# EAGLE design TRF_PCB_021726 (EAGLE 9.6.2)
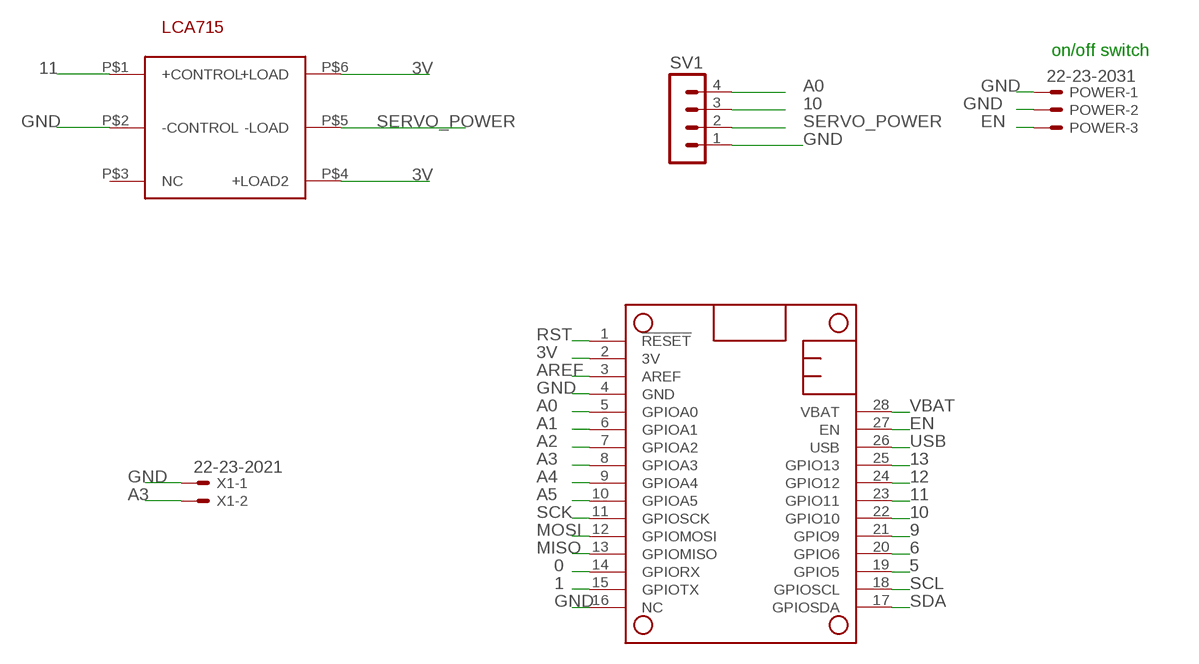
[diagram p0: schematic, sheet 1]

## Parts
MS2  MICROSHIELD_NODIM  [MICROSHIELD_DIM]
POWER  22-23-2031  [22-23-2031]
SSR3  LCA715S  [LCA7XX]
SV1  MA04-1  [MA04-1]
X1  22-23-2021  [22-23-2021]

## Nets
0: MS2.14(GPIORX)
1: MS2.15(GPIOTX)
3V: MS2.2(3V) SSR3.P$4(+LOAD2) SSR3.P$6(+LOAD)
5: MS2.19(GPIO5)
6: MS2.20(GPIO6)
9: MS2.21(GPIO9)
10: MS2.22(GPIO10) SV1.3
11: MS2.23(GPIO11) SSR3.P$1(+CONTROL)
12: MS2.24(GPIO12)
13: MS2.25(GPIO13)
A0: MS2.5(GPIOA0) SV1.4
A1: MS2.6(GPIOA1)
A2: MS2.7(GPIOA2)
A3: MS2.8(GPIOA3) X1.2
A4: MS2.9(GPIOA4)
A5: MS2.10(GPIOA5)
AREF: MS2.3(AREF)
EN: MS2.27(EN) POWER.3
GND: MS2.4(GND) MS2.16(NC) POWER.1 POWER.2 SSR3.P$2(-CONTROL) SV1.1 X1.1
MISO: MS2.13(GPIOMISO)
MOSI: MS2.12(GPIOMOSI)
RST: MS2.1(!RESET)
SCK: MS2.11(GPIOSCK)
SCL: MS2.18(GPIOSCL)
SDA: MS2.17(GPIOSDA)
SERVO_POWER: SSR3.P$5(-LOAD) SV1.2
USB: MS2.26(USB)
VBAT: MS2.28(VBAT)
Unconnected: SSR3.P$3(NC)

## Notes on the sheet
- on/off switch

## Library data of the parts
MS2 = M4:MICROSHIELD
POWER = con-molex:22-23-2031: .100" (2.54mm) Center Header - 3 Pin; MF: MOLEX; MPN: 22-23-2031; OC_FARNELL: 1462950; OC_NEWARK: 30C0862
SSR3 = Mohamed's-library:LCA715S
SV1 = con-lstb:MA04-1: PIN HEADER; OC_FARNELL: unknown; OC_NEWARK: unknown
X1 = con-molex:22-23-2021: .100" (2.54mm) Center Header - 2 Pin; MF: MOLEX; MPN: 22-23-2021; OC_FARNELL: 1462926; OC_NEWARK: 25C3832

## Board
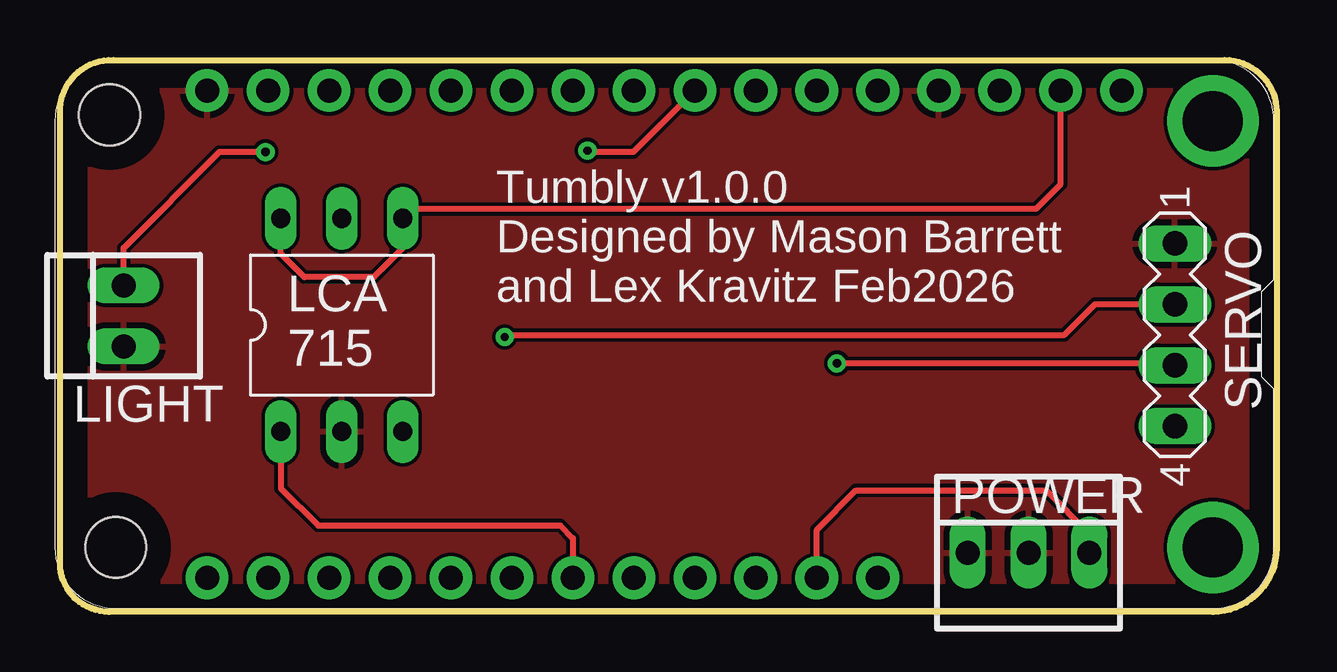
[diagram p1: board, top side]
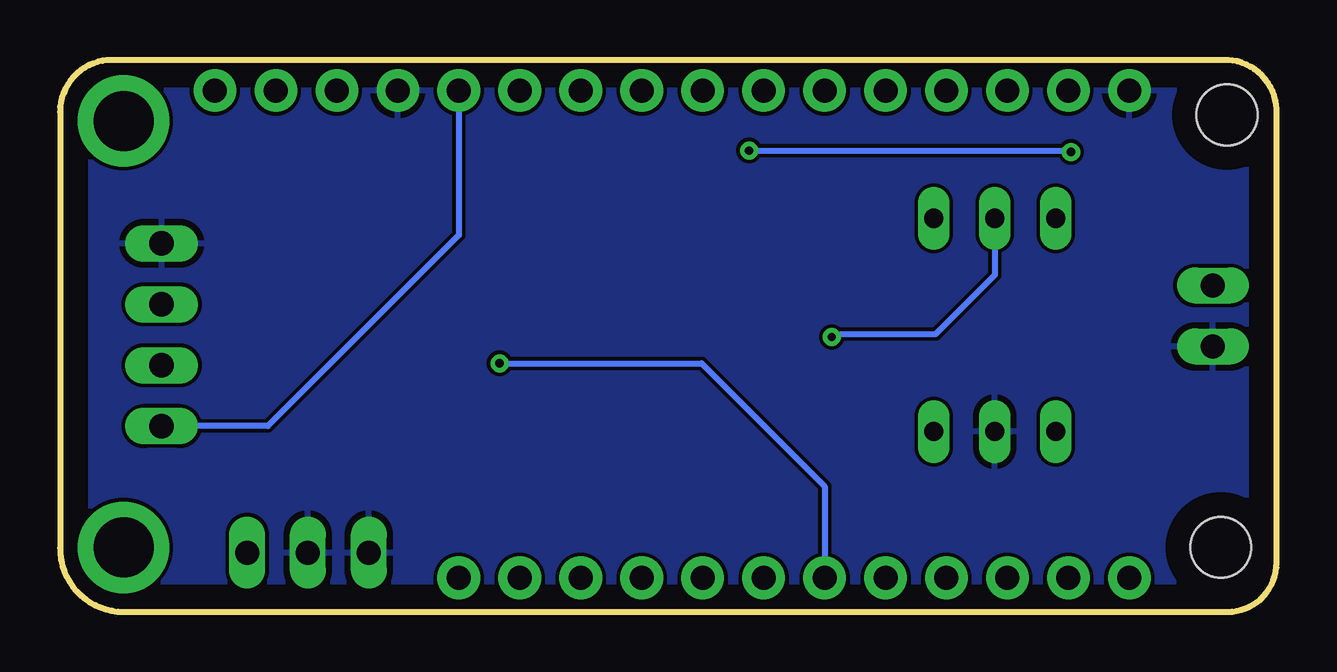
[diagram p2: board, bottom side, seen from below]

Size 50.69 x 23.01 mm. Coordinates in mm from the lower left corner, seen from the top.
Outline: 48.52,23.01 arc-90 50.69,20.85 50.69,2.65 arc-90 48.04,0 2.04,0 arc-90 0,2.04 0,20.94 arc-90 2.22,23.01 48.52,23.01
Copper layers (1*16): Top 0.035mm / dielectric 1.5mm / Bottom 0.035mm
Design rules "default": minimum track width 6mil, minimum drill 0.35mm, track to track 6mil, track to pad 6mil, pad to pad 6mil, via to via 6mil, smd to smd 6mil, copper to edge 40mil, drill to drill 6mil, minimum pad ring 10mil, minimum via ring 8mil, stop-mask expansion 4mil, vias tented up to drill 0mil, thermal gap 10mil

### Footprints (pad centres in the part's own frame; a part is rotated, then mirrored left to right if it is on the bottom)
MICROSHIELD_DIM = drill 1 pad 1.778: 1 6.35,1.27; 2 8.89,1.27; 3 11.43,1.27; 4 13.97,1.27; 5 16.51,1.27; 6 19.05,1.27; 7 21.59,1.27; 8 24.13,1.27; 9 26.67,1.27; 10 29.21,1.27; 11 31.75,1.27; 12 34.29,1.27; 13 36.83,1.27; 14 39.37,1.27; 15 41.91,1.27; 16 44.45,1.27; 17 44.45,21.59; 18 41.91,21.59; 19 39.37,21.59; 20 36.83,21.59; 21 34.29,21.59; 22 31.75,21.59; 23 29.21,21.59; 24 26.67,21.59; 25 24.13,21.59; 26 21.59,21.59; 27 19.05,21.59; 28 16.51,21.59 | drill 2.5 pad 3.81: P$1 2.54,20.32; P$2 2.54,2.54 | hole 2.54: 48.26,20.32; 48.514,2.286
22-23-2031 = drill 1 long: 1 -2.54,0; 2 0,0; 3 2.54,0
LCA7XX = drill 0.8 long: P$1 -5.08,2.54; P$2 -5.08,0; P$3 -5.08,-2.54; P$4 3.81,-2.54; P$5 3.81,0; P$6 3.81,2.54
MA04-1 = drill 1.016 long: 1 -3.81,0; 2 -1.27,0; 3 1.27,0; 4 3.81,0
22-23-2021 = drill 1 long: 1 -1.27,0; 2 1.27,0

### Placement (x,y rotation side)
MS2  50.58,23.01 180 top
POWER  40.36,2.47 0 top
SSR3  11.74,12.6 90 top
SV1  46.45,11.55 270 top
X1  2.65,12.34 90 top

### Tracks (layer width: path | path; a pad name or v marks a point on that pad's centre or on a via)
3V
  Top 0.254: SSR3.P$6 9.2,14.94 10.18,13.96 13.08,13.96 14.28,15.16 SSR3.P$4 14.67,16.8 40.66,16.8 41.7,17.84 MS2.2
10  (via drill 0.35)
  Top 0.254: SV1.3 46.37,10.36 v32.37,10.36
  Bottom 0.254: v32.37,10.36 23.96,10.36 18.83,5.24 MS2.22
11
  Top 0.254: SSR3.P$1 9.2,5.16 10.76,3.6 20.85,3.6 21.37,3.07 MS2.23
A0
  Bottom 0.254: MS2.5 34.07,15.7 42.03,7.74 SV1.4
A3  (via drill 0.35)
  Top 0.254: X1.2 2.65,15.18 6.64,19.17 v8.56,19.17 | MS2.8 23.89,19.17 22.04,19.17 v21.98,19.23
  Bottom 0.254: v21.98,19.23 8.63,19.23 v8.56,19.17
EN
  Top 0.254: MS2.27 31.53,3.43 33.16,5.06 41.09,5.06 42.9,3.25 POWER.3
GND
  pour Bottom: 1,51.99 101.16,1.18 -3.66,-3.15
  pour Top: -1.46,56.18 104.23,4.6 -1.46,-4.11
SERVO_POWER  (via drill 0.35)
  Top 0.254: v18.53,11.46 18.62,11.55 41.85,11.55 43.13,12.83 SV1.2
  Bottom 0.254: SSR3.P$5 11.74,14.05 14.2,11.58 18.41,11.58 v18.53,11.46

### Text on the board
tPlace: Tumbly v1.0.0 / Designed by Mason Barrett / and Lex Kravitz Feb2026 | LCA / 715 | LIGHT | SERVO | POWER